# Altium schematic sheet FuelPump.SchDoc
size A4
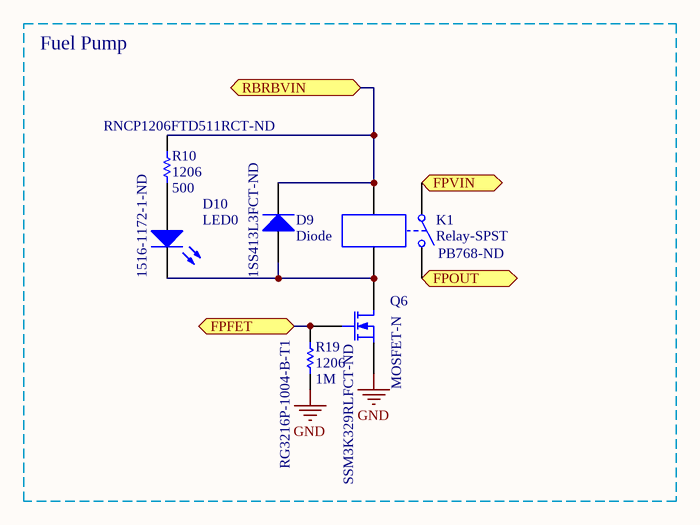
[diagram p0: FuelPump.SchDoc]

## Parts
D9  Diode  Supplier Part Number 1: 1SS413L3FCT-ND  [1SS413]
D10  LED0  Supplier Part Number 1: 1516-1172-1-ND  [C1206]
K1  Relay-SPST  Supplier Part Number 1: PB768-ND  [PB114012]
Q6  MOSFET-N  Supplier Part Number 1: SSM3K329RLFCT-ND  [SOT23f]
R10  1206  value 500  Supplier Part Number 1: RNCP1206FTD511RCT-ND  [C1206]
R19  1206  value 1M  Supplier Part Number 1: RG3216P-1004-B-T1  [1206 (High Density)]

## Blocks framed on the sheet
Fuel Pump: D9 D10 K1 Q6 R10 R19

## Ports
FPFET (bidir), FPOUT (bidir), FPVIN (bidir), RBRBVIN (bidir)

## Nets
GND: Q6.3(S) R19.1
FPFET: Q6.2(G) R19.2 ; port FPFET
FPOUT: K1.2 ; port FPOUT
FPVIN: K1.1 ; port FPVIN
RBRBVIN: D9.2(K) K1.3 R10.1 ; port RBRBVIN
NetD9_1: D9.1(A) D10.2(K) K1.4 Q6.1(D)
NetD10_1: D10.1(A) R10.2

## Library data of the parts
D9 = Diode: Switching diode; Published: 8-Jun-2000; LatestRevisionDate: 17-Jul-2002; LatestRevisionNote: Re-released for DXP Platform.; PackageVersion: Sep-1996; PackageReference: SMC; Publisher: Altium Limited; PackageDescription: DO-214-AB/SMC; 2 C-Bend Leads; Body 7.9 x 5.9 mm, inc. leads (LxW); Code_JEDEC: DO-214-AB; Supplier 1: Digi-Key
D10 = LED0: Typical INFRARED GaAs LED; Published: 8-Jun-2000; LatestRevisionDate: 08-Jul-2005; LatestRevisionNote: Mech Layer 1 removed.; PackageReference: LED-0; Publisher: Altium Limited; PackageDescription: LED; 2 Leads; Supplier 1: Digi-Key
K1 = Relay-SPST: Single-Pole Single-Throw Relay; Published: 24-Mar-1999; LatestRevisionDate: 17-Jul-2002; LatestRevisionNote: Re-released for DXP Platform.; PackageReference: MODULE4; Publisher: Altium Limited; Supplier 1: Digi-Key
Q6 = MOSFET-N: N-Channel MOSFET; Published: 8-Jun-2000; LatestRevisionDate: 17-Jul-2002; LatestRevisionNote: Re-released for DXP Platform.; PackageVersion: 1995/1996; PackageReference: E3; Publisher: Altium Limited; PackageDescription: TO, Flat Index; 3 In-Line, Axial Leads; Body Dia. 4.6mm; Lead Dia. 0.5 mm (max); Supplier 1: Digi-Key
R10 R19 = Res1: Resistor; Published: 8-Jun-2000; LatestRevisionDate: 17-Jul-2002; LatestRevisionNote: Re-released for DXP Platform.; PackageReference: AXIAL-0.3; Publisher: Altium Limited; PackageDescription: Axial Device, Thru-Hole; 2 Leads; 0.3 in Pin Spacing; Supplier 1: Digi-Key